# EasyEDA Pro project EasyEDApro.epro, schematic EnergyMeter
Create Date: 2023-12-29; Page Name: P1; Project Name: Energy Monitoring DIN dev release_v2_jack 3.5; Schematic Name: energy meter; Update Date: 2024-01-20; Company: ROBONOMICS.NETWORK; Drawed: ludovich88; Page Size: A3; Part Number: RNDR-1; Reviewed: EnsRationis; Version: 0.1
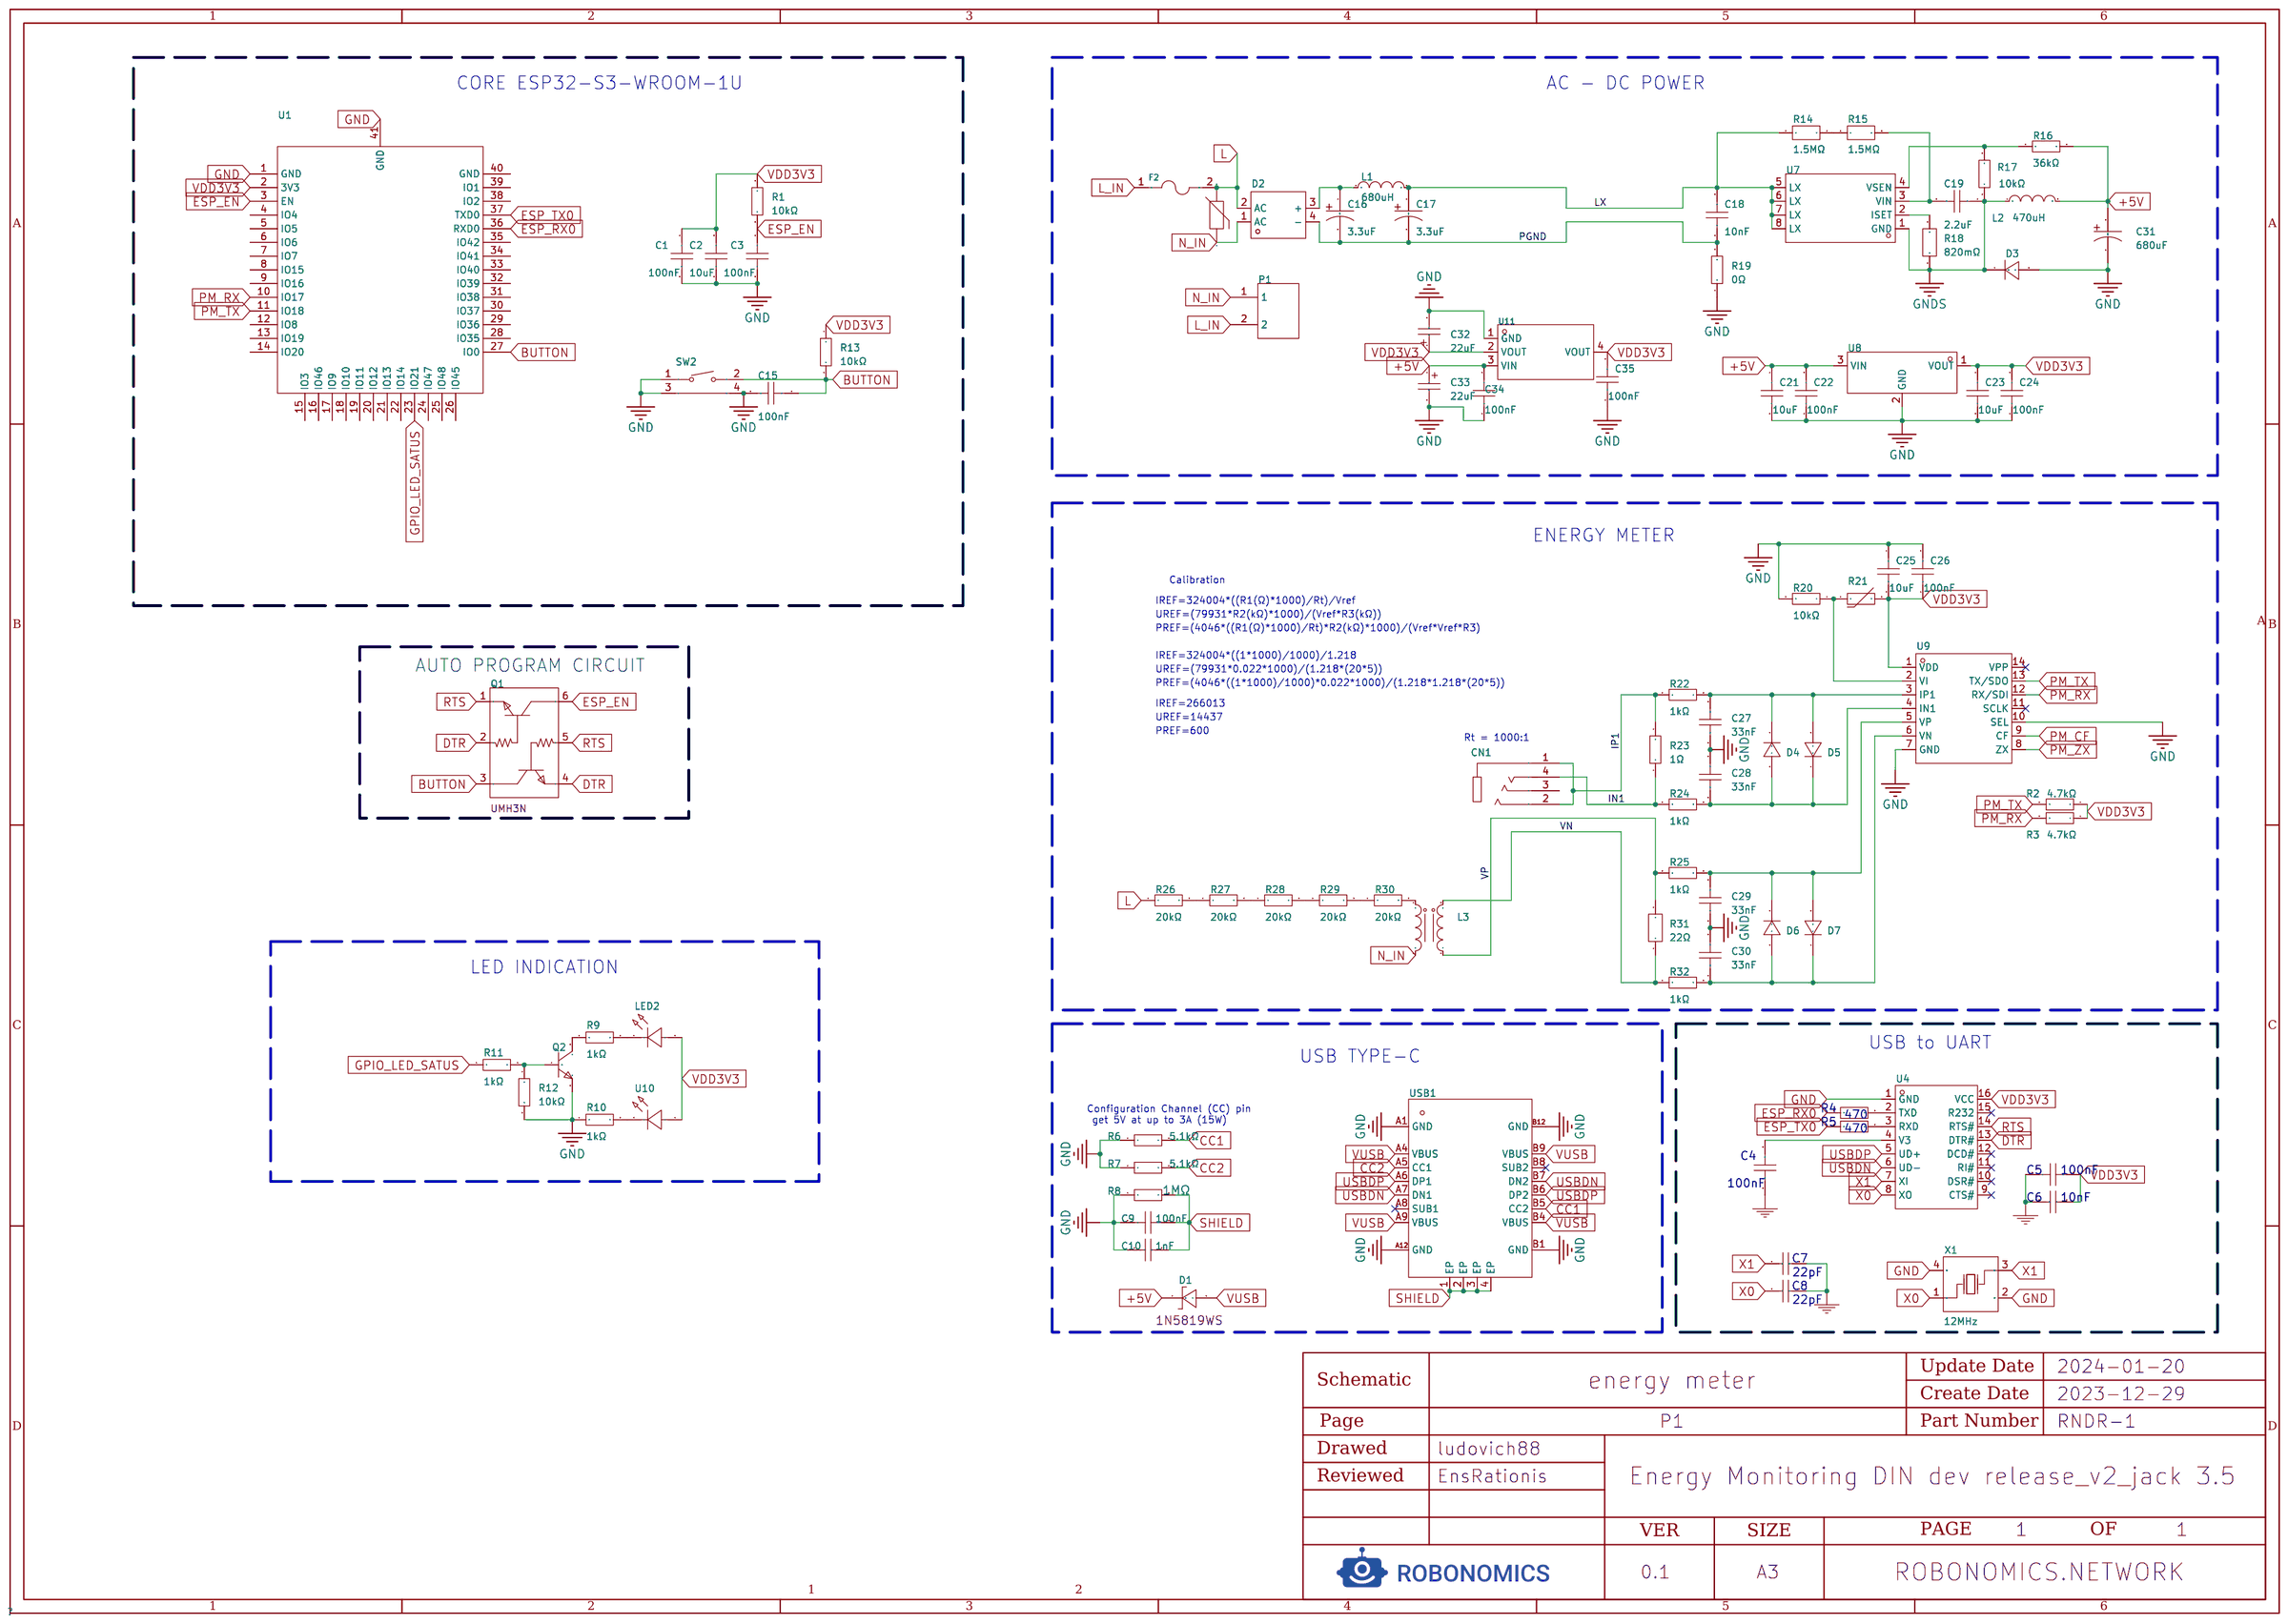
[diagram p0: schematic sheet]

## Parts
C1  100nF  [C0603]
C2  10uF  [c0603]
C3  100nF  [C0603]
C4  100nF  [C0603]
C5  100nF  [C0603]
C6  10nF  [C0603]
C7  22pF  [C0603]
C8  22pF  [C0603]
C9  100nF  [C0603]
C10  1nF  [C0603]
C15  100nF  [C0603]
C16  3.3uF  [CAP-TH_BD8.0-P3.50-D0.6-FD]
C17  3.3uF  [CAP-TH_BD8.0-P3.50-D0.6-FD]
C18  10nF  [C1206]
C19  2.2uF  [C0805]
C21  10uF  [C0603]  (no BOM)
C22  100nF  [C0603]  (no BOM)
C23  10uF  [C0603]  (no BOM)
C24  100nF  [C0603]  (no BOM)
C25  10uF  [C0603]
C26  100nF  [C0603]
C27  33nF  [C0603]
C28  33nF  [C0603]
C29  33nF  [C0603]
C30  33nF  [C0603]
C31  680uF  [CAP-SMD_L7.3-W4.3]
C32  22uF  [CASE-A_3216]
C33  22uF  [CASE-A_3216]
C34  100nF  [C0603]
C35  100nF  [C0603]
CN1  PJ-320D  [AUDIO-SMD_PJ-320D]
D1  -  [SOD-323_L1.8-W1.3-LS2.5-RD]
D2  MB10F  [MBF_L4.8-W3.9-P2.50-LS6.7-BL]
D3  ES1J  [SMA_L4.3-W2.6-LS5.2-RD]
D4  1N4148WS  [SOD-323_L1.8-W1.3-LS2.5-RD]
D5  1N4148WS  [SOD-323_L1.8-W1.3-LS2.5-RD]
D6  1N4148WS  [SOD-323_L1.8-W1.3-LS2.5-RD]
D7  1N4148WS  [SOD-323_L1.8-W1.3-LS2.5-RD]
F2  JFC2410-1200FS  [F2410]
L1  680uH  [IND-SMD_L6.0-W6.0]
L2  470uH  [IND-SMD_L4.0-W4.0]
L3  HPT225A-G  [XFMR-TH_4P-L19.0-10.0-P7.20]
LED2  XL-4008UGC  [LED-SMD_L4.0-W1.4-RD_GREEN]
P1  WJ128V-5.0-2P  [CONN-TH_2P-P5.00_WJ128V-5.0-2P]
Q1  -  [SC-70-6_L2.2-W1.3-P0.65-LS2.1-BR]
Q2  SS8050  [SOT-23-3_L2.9-W1.6-P1.90-LS2.8-BR]
R1  10kΩ  [R0603]
R2  4.7kΩ  [R0603]
R3  4.7kΩ  [R0603]
R4  470  [R0603]
R5  470  [R0603]
R6  5.1kΩ  [R0603]
R7  5.1kΩ  [R0603]
R8  1MΩ  [R0603]
R9  1kΩ  [R0603]
R10  1kΩ  [R0603]
R11  1kΩ  [R0603]
R12  10kΩ  [R0603]
R13  10kΩ  [R0603]
R14  1.5MΩ  [R1206]
R15  1.5MΩ  [R1206]
R16  36kΩ  [R0805]
R17  10kΩ  [R0805]
R18  820mΩ  [R0805]
R19  0Ω  [R0805]
R20  10kΩ  [R0603]
R21  SDNT2012X103F3950FTF  [R0805]
R22  1kΩ  [R0603]
R23  1Ω  [R0603]
R24  1kΩ  [R0603]
R25  1kΩ  [R0603]
R26  20kΩ  [R0603]
R27  20kΩ  [R0603]
R28  20kΩ  [R0603]
R29  20kΩ  [R0603]
R30  20kΩ  [R0603]
R31  22Ω  [R0603]
R32  1kΩ  [R0603]
RV1  RM07D471KC14E100  [RES-TH_L9.5-W3.8-P5.08-D0.6-S2.5]
SW2  TS-1010-C-A  [KEY-SMD_TX-1010-X-X]
U1  ESP32-S3-WROOM-1U-N16  [WIRELM-SMD_ESP32-S3-WROOM-1U]
U4  -  [SOIC-16_L9.9-W3.9-P1.27-LS6.0-BL]
U7  SY50282FAC  [SOIC-8_L4.9-W3.9-P1.27-LS6.0-BL]
U8  LD2981ABU33TR  [SOT-89-3_L4.5-W2.5-P1.50-LS4.2-BR]  (no BOM)
U9  BL0940  [TSSOP-14_L5.0-W4.4-P0.65-LS6.4-BL]
U10  XL-4008SURC  [LED-SMD_L4.0-W1.4-FD_C9900036310]
U11  AMS1117-3.3  [SOT-223-3_L6.5-W3.4-P2.30-LS7.0-BR]
USB1  KH-TYPE-C-16P  [USB-C-SMD_KH-TYPE-C-16P]
X1  12MHz  [OSC-SMD_4P-L3.2-W2.5-BL]

## Library data of the parts
C1 C3 = 0603F104Z500CT: Capacitance:100nFTolerance:-20%~+80%Tolerance:-20%~+80%VoltageRated:50VTemperatureCoefficient:Y5V; LCSC Part Name: 100nF-20%~+80%50V; Supplier Part: C83060; Manufacturer: 华新科(Walsin); Supplier Footprint: 0603; JLCPCB Part Class: ExtendedPart; Datasheet: https://atta.szlcsc.com/upload/public/pdf/source/20161119/1479540179445.pdf; Supplier: LCSC; Tolerance: -20%~+80%; Voltage Rated: 50V; Temperature Coefficient: Y5V
C2 = cl10a106kp8nnnc: 容值:10uF;精度:±10%;额定电压:10V;温度系数:X5R;; LCSC Part Name: 10uF±10%10V; Supplier Part: C19702; Manufacturer: SAMSUNG(三星); Manufacturer Part: CL10A106KP8NNNC; Supplier Footprint: 0603; JLCPCB Part Class: BasicPart; Datasheet: https://atta.szlcsc.com/upload/public/pdf/source/20160103/1457707703378.pdf; Supplier: LCSC; Tolerance: ±10%; Voltage Rated: 10V; Temperature Coefficient: X5R
C4 C5 = CC0603KRX7R9BB104: Supplier: LCSC; Manufacturer: YAGEO; Supplier Part: C14663; JLCPCB Part Class: BasicPart
C6 = 0603B103K500NT: Supplier: LCSC; Manufacturer: FH; Supplier Part: C57112; JLCPCB Part Class: BasicPart
C7 C8 = CL10C220JB8NNNC: Supplier: LCSC; Manufacturer: SAMSUNG; Supplier Part: C1653; JLCPCB Part Class: BasicPart
C9 = CC0603KRX7R9BB104: Capacitance:100nFTolerance:±10%Tolerance:±10%VoltageRated:50VTemperatureCoefficient:X7R; LCSC Part Name: 100nF±10%50V; Supplier Part: C14663; Manufacturer: YAGEO(国巨); Supplier Footprint: 0603; JLCPCB Part Class: BasicPart; Datasheet: https://atta.szlcsc.com/upload/public/pdf/source/20170116/1484561234239.pdf; Supplier: LCSC; Tolerance: ±10%; Voltage Rated: 50V; Temperature Coefficient: X7R
C10 = CL10B102KB8NNNC: Capacitance:1nFTolerance:±10%Tolerance:±10%VoltageRated:50VTemperatureCoefficient:X7R; LCSC Part Name: 1nF±10%50V; Supplier Part: C1588; Manufacturer: SAMSUNG(三星); Supplier Footprint: 0603; JLCPCB Part Class: BasicPart; Datasheet: https://atta.szlcsc.com/upload/public/pdf/source/20160103/1457707679526.pdf; Supplier: LCSC; Tolerance: ±10%; Voltage Rated: 50V; Temperature Coefficient: X7R
C15 C22 C24 C26 C34 C35 = 0603ZC104KAT2A: Capacitance:Tolerance:±10%Tolerance:±10%VoltageRated:TemperatureCoefficient:; LCSC Part Name: 100nF±10%10V; Supplier Part: C597251; Manufacturer: KyoceraAVX; Supplier Footprint: 0603; Datasheet: https://atta.szlcsc.com/upload/public/pdf/source/20200611/C596996_5C2870FCBE04273D0B42880C13DA8C38.pdf; Supplier: LCSC; Tolerance: ±10%
C16 C17 = RC400M3R3LO8*12TH-2A1E: Capacitance:Tolerance:±20%Tolerance:±20%RatedVoltage:φD:L:LeadSpacing:RippleCurrent:-Lifetime@Temp:-OperatingTemperature:-40℃~+105℃OperatingTemperature:-40℃~+105℃; LCSC Part Name: 3.3uF±20%400V; Supplier Part: C357600; Manufacturer: BERYL(绿宝石); Supplier Footprint: 插件,D8xL12mm; JLCPCB Part Class: ExtendedPart; Datasheet: https://atta.szlcsc.com/upload/public/pdf/source/20190103/C357600_EA153F20CFA28085E3801EB936F22A0F.pdf; Supplier: LCSC; Tolerance: ±20%; Operating Temperature: -40℃~+105℃
C18 = 1206B103K102CT_C77498: Capacitance:Tolerance:±10%Tolerance:±10%VoltageRated:TemperatureCoefficient:; LCSC Part Name: 10nF±10%1kV; Supplier Part: C77498; Manufacturer: Walsin(华新科); Manufacturer Part: 1206B103K102CT; Supplier Footprint: 1206; Datasheet: https://atta.szlcsc.com/upload/public/pdf/source/20180823/C77498_F5DB9DEE771DDE1CDD0779C01702A5D3.pdf; Supplier: LCSC; Tolerance: ±10%
C19 = CL21A225KBQNNNE: Capacitance:Tolerance:±10%Tolerance:±10%VoltageRated:TemperatureCoefficient:; LCSC Part Name: 2.2uF±10%50V; Supplier Part: C377773; Manufacturer: SAMSUNG(三星); Supplier Footprint: 0805; JLCPCB Part Class: ExtendedPart; Datasheet: https://atta.szlcsc.com/upload/public/pdf/source/20190327/C377773_F663556E8B678C5EA7A210E6B154453B.pdf; Supplier: LCSC; Tolerance: ±10%
C21 C23 C25 = CL10A106MQ8NNNC: Capacitance:Tolerance:±20%Tolerance:±20%VoltageRated:TemperatureCoefficient:; LCSC Part Name: 10uF±20%6.3V; Supplier Part: C1691; Manufacturer: SAMSUNG(三星); Supplier Footprint: 0603; JLCPCB Part Class: ExtendedPart; Datasheet: https://atta.szlcsc.com/upload/public/pdf/source/20160103/1457707690948.pdf; Supplier: LCSC; Tolerance: ±20%
C27-C30 = CC0603JRX7R9BB333: Capacitance:Tolerance:±5%Tolerance:±5%VoltageRated:TemperatureCoefficient:; LCSC Part Name: 33nF±5%50V; Supplier Part: C327162; Manufacturer: YAGEO(国巨); Supplier Footprint: 0603; JLCPCB Part Class: ExtendedPart; Datasheet: https://atta.szlcsc.com/upload/public/pdf/source/20181031/C327162_E0FA0E4D62FC939BEC1D516A6479F390.pdf; Supplier: LCSC; Tolerance: ±5%
C31 = TAJE687K006RNJ: Capacitance:Tolerance:±10%Tolerance:±10%RatedVoltage:EquivalentSeriesResistance(ESR):500mΩ@100kHzOperatingTemperature:-55℃~+125℃OperatingTemperature:-55℃~+125℃; LCSC Part Name: 680uF±10%6.3V; Supplier Part: C308811; Manufacturer: KyoceraAVX; Supplier Footprint: CASE-E-7343; JLCPCB Part Class: ExtendedPart; Datasheet: https://atta.szlcsc.com/upload/public/pdf/source/20181031/C308811_5A7B8BD02B1566F52935A1016FD2A024.pdf; Supplier: LCSC; Tolerance: ±10%; Equivalent Series Resistance(ESR): 500mΩ@100kHz; Operating Temperature: -55℃~+125℃
C32 C33 = TAJA226K010RNJ: Capacitance: Tolerance:±10% Tolerance:±10% Rated Voltage: Equivalent Series Resistance(ESR):3Ω@100kHz Operating Temperature:-55℃~+125℃ Operating Temperature:-55℃~+125℃; LCSC Part Name: 22uF ±10% 10V; Supplier Part: C11366; Manufacturer: Kyocera AVX; JLCPCB Part Class: Extended Part; Datasheet: https://atta.szlcsc.com/upload/public/pdf/source/20160107/1457707744993.pdf; Supplier: LCSC; Tolerance: ±10%; Equivalent Series Resistance(ESR): 3Ω@100kHz; Operating Temperature: -55℃~+125℃
CN1 = PJ-320D_C431535: Connector Type:3.5mm耳机座 Current Rating (Max):300mA Voltage Rating (Max):50V Operating Temperature Range:-16℃~+65℃ Operating Temperature Range:-16℃~+65℃; LCSC Part Name: 3.5mm耳机座; Supplier Part: C431535; Manufacturer: SHOU HAN(首韩); Supplier Footprint: SMD; JLCPCB Part Class: Extended Part; Datasheet: https://atta.szlcsc.com/upload/public/pdf/source/20190925/C431535_8B274506621F6117FB020BF07A197848.pdf; Supplier: LCSC; Connector Type: 3.5mm耳机座; Current Rating (Max): 300mA; Voltage Rating (Max): 50V; Operating Temperature Range: -16℃~+65℃
D1 = 1N5819WS: ReverseVoltage(Vr):40VAverageRectifiedCurrent(Io):1AForwardVoltage(Vf@If):600mV@1A; LCSC Part Name: 40V1A600mV@1A; Supplier Part: C191023; Manufacturer: Hottech(合科泰); Supplier Footprint: SOD-323; JLCPCB Part Class: BasicPart; Datasheet: https://atta.szlcsc.com/upload/public/pdf/source/20180614/C191023_3C6A6398B911F3A4C23E7538EE054643.pdf; Supplier: LCSC; Reverse Voltage (Vr): 40V; Average Rectified Current (Io): 1A; Forward Voltage (Vf@If): 600mV@1A
D2 = MB10F_C306850: ReverseVoltage(Vr):AverageRectifiedCurrent(Io):ForwardVoltage(Vf@If):1V@500mAReverseLeakageCurrent(Ir):5uA@1kVPeakForwardSurgeCurrent:OperatingTemperature:-55℃~+150℃@(Tj)OperatingTemperature:-55℃~+150℃@(Tj); LCSC Part Name: 1kV800mA; Supplier Part: C306850; Manufacturer: BORN(伯恩半导体); Supplier Footprint: MBF; JLCPCB Part Class: ExtendedPart; Datasheet: https://atta.szlcsc.com/upload/public/pdf/source/20180927/C306850_59365E2CFC1E948275A4282033719DF3.pdf; Supplier: LCSC; Forward Voltage (Vf@If): 1V@500mA; Reverse Leakage Current (Ir): 5uA@1kV; Operating Temperature: -55℃~+150℃@(Tj)
D3 = ES1J_C115404: Supplier Part: C115404; Manufacturer: 晶导微电子; Supplier Footprint: SMA(DO-214AC); Datasheet: https://atta.szlcsc.com/upload/public/pdf/source/20170704/1499151315665.pdf; Supplier: LCSC
D4-D7 = 1N4148WS_C2128: DiodeConfiguration:PowerDissipation:ReverseVoltage(Vr):AverageRectifiedCurrent(Io):ForwardVoltage(Vf@If):1.25V@150mAReverseLeakageCurrent:1uA@75VReverseRecoveryTime(trr):OperatingTemperature:+150℃@(Tj)OperatingTemperature:+150℃@(Tj; LCSC Part Name: 100V150mA4nsT4; Supplier Part: C2128; Manufacturer: CJ(江苏长电/长晶); Supplier Footprint: SOD-323; JLCPCB Part Class: BasicPart; Datasheet: https://atta.szlcsc.com/upload/public/pdf/source/20140809/1457707208178.pdf; Supplier: LCSC; Forward Voltage (Vf@If): 1.25V@150mA; Reverse Leakage Current: 1uA@75V; Operating Temperature: +150℃@(Tj)
F2 = JFC2410-1200FS: Type:SMD Fuse Current Rating:2A Voltage Rating  (AC):250V Breaking Capacity:50A Operating Temperature:-55℃~+125℃ Operating Temperature:-55℃~+125℃; LCSC Part Name: 250V贴片式保险丝; Supplier Part: C136365; Manufacturer: JDTfuse(集电通); Supplier Footprint: SMD; JLCPCB Part Class: Extended Part; Datasheet: https://atta.szlcsc.com/upload/public/pdf/source/20230515/4DD82964BD259009D7CA201DAB95185E.pdf; Supplier: LCSC; Type: SMD Fuse; Current Rating: 2A; Voltage Rating  (AC): 250V; Breaking Capacity: 50A; Operating Temperature: -55℃~+125℃
L1 = YNR6045-681M: Inductance:Tolerance:±20%Tolerance:±20%RatedCurrent:DCResistance(DCR):; LCSC Part Name: 680uH±20%330mA2.5Ω; Supplier Part: C497844; Manufacturer: YJYCOIN(益嘉源); Supplier Footprint: SMD,6x6mm; JLCPCB Part Class: ExtendedPart; Datasheet: https://atta.szlcsc.com/upload/public/pdf/source/20200317/C497838_ADAADDA66AFC043F2D8B9A62FB946728.pdf; Supplier: LCSC; Tolerance: ±20%
L2 = PNLS4030-471: Inductance: Tolerance:±20% Tolerance:±20% Rated Current: Type:磁胶电感 DC Resistance (DCR): Saturation Current (Isat):- Ratings:-; LCSC Part Name: 470uH ±20%; Supplier Part: C2849480; Manufacturer: DMBJ(振宝佳); Supplier Footprint: SMD,4x4x3mm; JLCPCB Part Class: Extended Part; Datasheet: https://atta.szlcsc.com/upload/public/pdf/source/20211011/C2849563_90EF936162E15AB6B17B47214801A168.pdf; Supplier: LCSC; Tolerance: ±20%; Type: 磁胶电感
L3 = HPT225A-G: CurrentRatio:1:1CurrentRating:2mAFrequencyRange:0.02kHz~10kHzSecondarySideInductance:-DCRPrimarySide(Max):115ΩDCRSecondarySide(Max):115ΩHighPotential:4000V@AC; Supplier Part: C254112; Manufacturer: HOP(北京霍远); Supplier Footprint: 插件; JLCPCB Part Class: ExtendedPart; Datasheet: https://atta.szlcsc.com/upload/public/pdf/source/20201208/C254112_A7B3C0B9ED08E71DD9E60AC055CA5EE3.pdf; Supplier: LCSC; Current Ratio: 1:1; Current Rating: 2mA; Frequency Range: 0.02kHz~10kHz; DCR Primary Side (Max): 115Ω; DCR Secondary Side (Max): 115Ω; High Potential: 4000V@AC
LED2 = XL-4008UGC: EmittedColor:EmeraldLensColor:ColorlesstransparenceDominantWavelength:520nm~525nmDominantWavelength:520nm~525nmPeakWavelength:525nmForwardCurrent:50mAPowerDissipation:125mWViewingAngle:120°MountingSytle:SidestickersOperatingTemperatur; LCSC Part Name: 侧贴; Supplier Part: C2843772; Manufacturer: XINGLIGHT(成兴光); Supplier Footprint: SMD,1.4x4mm; JLCPCB Part Class: ExtendedPart; Datasheet: https://atta.szlcsc.com/upload/public/pdf/source/20221102/5120FC94C7C2123DB0544AD5FB85956A.pdf; Supplier: LCSC; Emitted Color: Emerald; Lens Color: Colorlesstransparence; Dominant Wavelength: 520nm~525nm; Peak Wavelength: 525nm; Forward Current: 50mA; Power Dissipation: 125mW; Viewing Angle: 120°; Mounting Sytle: Sidestickers; Operating Temperature: -30℃~+85℃
P1 = WJ128V-5.0-2P: Pitch:5mmStructure:1x2PNumberofRows:1NumberofPINsPerRow:2MountingStyle:直针CurrentRating(Max):20AVoltageRating(Max):250VWireGauge-AWG:12~22WireGauge-AWG:12~22WireGauge-mm2:2.5WireGauge-mm2:2.5OperatingTemperatureRange:-40; LCSC Part Name: 5mm1x2P排数:1每排P数:2直针可拼接; Supplier Part: C8269; Manufacturer: KANGNEX(康奈克斯电气); Supplier Footprint: 插件,P=5mm; JLCPCB Part Class: ExtendedPart; Datasheet: https://atta.szlcsc.com/upload/public/pdf/source/20191225/C8269_1FF44D6D2E83DB14A7CA266A410FD9AD.pdf; Supplier: LCSC; Pitch: 5mm; Structure: 1x2P; Number of Rows: 1; Number of PINs Per Row: 2; Mounting Style: 直针; Current Rating (Max): 20A; Voltage Rating (Max): 250V; Wire Gauge - AWG: 12~22; Wire Gauge - mm2: 2.5; Operating Temperature Range: -40℃~+105℃; Color: Green
Q1 = UMH3N: TransistorType:2个NPN-预偏置PowerDissipation(Pd):150mWCollectorCurrent(Ic):100mACollector-EmitterBreakdownVoltage(Vceo):50V; LCSC Part Name: 2个NPN-预偏置100mA50V; Supplier Part: C62892; Manufacturer: CJ(江苏长电/长晶); Supplier Footprint: SC-70-6(SOT-363); JLCPCB Part Class: ExtendedPart; Datasheet: https://atta.szlcsc.com/upload/public/pdf/source/20151109/1457707575095.pdf; Supplier: LCSC; Transistor Type: 2个NPN-预偏置; Power Dissipation (Pd): 150mW; Collector Current (Ic): 100mA; Collector-Emitter Breakdown Voltage (Vceo): 50V
Q2 = SS8050_C181160: TransistorType:Collector-EmitterBreakdownVoltage(Vceo):CollectorCurrent(Ic):PowerDissipation(Pd):CollectorCut-OffCurrent(Icbo):100nACollector-EmitterSaturationVoltage(VCE(sat)@Ic,Ib):500mV@800mA,80mADCCurrentGain(hFE@Ic,Vce):200@100; LCSC Part Name: NPN25V1.5AH档（200-350）; Supplier Part: C181160; Manufacturer: Hottech(合科泰); Supplier Footprint: SOT-23; JLCPCB Part Class: ExtendedPart; Datasheet: https://atta.szlcsc.com/upload/public/pdf/source/20220506/87BBA77FEE9CB4B19031AE933C67329E.pdf; Supplier: LCSC; Collector Cut-Off Current (Icbo): 100nA; Collector-Emitter Saturation Voltage (VCE(sat)@Ic,Ib): 500mV@800mA,80mA; DC Current Gain (hFE@Ic,Vce): 200@100mA,1V; Transition Frequency (fT): 100MHz; Operating Temperature: +150℃@(Tj)
R1 R12 R13 R20 = 0603WAF1002T5E: Type:厚膜电阻 Resistance:10kΩ Tolerance:±1% Tolerance:±1% Power(Watts):1/10W Temperature Coefficient:±100ppm/ Temperature Coefficient:±100ppm/ Overload Voltage (Max):75V Operating Temperature Range:-55~+155 Operating Temperature Range:-55~+155; LCSC Part Name: 10kΩ±1%1/10W; Supplier Part: C25804; Manufacturer: UNI-ROYAL(厚声); Supplier Footprint: 0603; JLCPCB Part Class: BasicPart; Datasheet: https://atta.szlcsc.com/upload/public/pdf/source/20200306/C422600_1E6D84923E4A46A82E41ADD87F860B5C.pdf; Supplier: LCSC; Type: 厚膜电阻; Tolerance: ±1%; Power(Watts): 1/10W; Temperature Coefficient: ±100ppm/; Overload Voltage (Max): 75V; Operating Temperature Range: -55~+155
R2 R3 = RMC06034K7JN: Resistance:Tolerance:±5%Tolerance:±5%Power(Watts):; LCSC Part Name: 4.7kΩ±5%100mW; Supplier Part: C269694; Manufacturer: Tyohm(幸亚电阻); Supplier Footprint: 0603; JLCPCB Part Class: ExtendedPart; Datasheet: https://atta.szlcsc.com/upload/public/pdf/source/20190115/C269694_8DB59FA47BFB5717A32940FE118C845B.pdf; Supplier: LCSC; Tolerance: ±5%
R4 R5 = 0603WAF4700T5E: Supplier: LCSC; Manufacturer: UniOhm; Supplier Part: C23179; JLCPCB Part Class: BasicPart
R6 R7 = 0603WAF5101T5E: Type:厚膜电阻 Resistance:5.1kΩ Tolerance:±1% Power(Watts):1/10W Temperature Coefficient:±100ppm/ Temperature Coefficient:±100ppm/ Overload Voltage (Max):75V Operating Temperature Range:-55~+155 Operating Temperature Range:-55~+155; LCSC Part Name: 5.1kΩ±1%; Supplier Part: C23186; Manufacturer: UNI-ROYAL(厚声); Supplier Footprint: 0603; JLCPCB Part Class: BasicPart; Datasheet: https://atta.szlcsc.com/upload/public/pdf/source/20200306/C422600_1E6D84923E4A46A82E41ADD87F860B5C.pdf; Supplier: LCSC; Type: 厚膜电阻; Tolerance: ±1%; Power(Watts): 1/10W; Temperature Coefficient: ±100ppm/; Overload Voltage (Max): 75V; Operating Temperature Range: -55~+155
R8 = 0603WAF1004T5E: LCSC Part Name: 1MΩ(1004)±1%编带; Supplier Part: C22935; Manufacturer: UNI-ROYAL(厚声); Supplier Footprint: 0603; JLCPCB Part Class: BasicPart; Datasheet: https://atta.szlcsc.com/upload/public/pdf/source/20170920/C22935_1505900992858982324.pdf; Supplier: LCSC
R9-R11 = RC0603FR-071KL: Resistance:Tolerance:±1%Tolerance:±1%Power(Watts):TemperatureCoefficient:±100ppm/℃TemperatureCoefficient:±100ppm/℃OverloadVoltage(Max):OperatingTemperatureRange:-55℃~+155℃OperatingTemperatureRange:-55℃~+155℃; LCSC Part Name: 1kΩ±1%100mW; Supplier Part: C22548; Manufacturer: YAGEO(国巨); Supplier Footprint: 0603; JLCPCB Part Class: ExtendedPart; Datasheet: https://atta.szlcsc.com/upload/public/pdf/source/20180312/7BD3618A8B6324EA6280B0497A051AB7.pdf; Supplier: LCSC; Tolerance: ±1%; Temperature Coefficient: ±100ppm/℃; Operating Temperature Range: -55℃~+155℃
R14 R15 = AC1206FR-071M5L: Power(Watts):250mWBodyLength:-Tolerance:OperatingTemperatureRange:OperatingTemperatureRange:φD:-BodyHeight:-Resistance:BodyWidth:-Type:ThickFilmResistorsTemperatureCoefficient:TemperatureCoefficient:OverloadVoltage(Max):; LCSC Part Name: 1.5MΩ±1%; Supplier Part: C229411; Manufacturer: YAGEO(国巨); Supplier Footprint: 1206; JLCPCB Part Class: ExtendedPart; Datasheet: https://atta.szlcsc.com/upload/public/pdf/source/20190415/C229411_FA1574342AB9C159EA3612F925293BBE.pdf; Supplier: LCSC; Power(Watts): 250mW; Type: ThickFilmResistors
R16 = 0805W8F3602T5E: Type:ThickFilmResistorsResistance:Tolerance:±1%Tolerance:±1%Power(Watts):TemperatureCoefficient:±100ppm/℃TemperatureCoefficient:±100ppm/℃OverloadVoltage(Max):OperatingTemperatureRange:-55℃~+155℃OperatingTemperatureRange:-55℃~+155℃; LCSC Part Name: 36kΩ±1%125mW; Supplier Part: C4360; Manufacturer: UNI-ROYAL(厚声); Supplier Footprint: 0805; JLCPCB Part Class: BasicPart; Datasheet: https://atta.szlcsc.com/upload/public/pdf/source/20200306/C422600_1E6D84923E4A46A82E41ADD87F860B5C.pdf; Supplier: LCSC; Type: ThickFilmResistors; Tolerance: ±1%; Temperature Coefficient: ±100ppm/℃; Operating Temperature Range: -55℃~+155℃
R17 = 0805W8F1002T5E: Type:ThickFilmResistorsResistance:Tolerance:±1%Tolerance:±1%Power(Watts):TemperatureCoefficient:±100ppm/℃TemperatureCoefficient:±100ppm/℃OverloadVoltage(Max):OperatingTemperatureRange:-55℃~+155℃OperatingTemperatureRange:-55℃~+155℃; LCSC Part Name: 10kΩ±1%125mW; Supplier Part: C17414; Manufacturer: UNI-ROYAL(厚声); Supplier Footprint: 0805; JLCPCB Part Class: BasicPart; Datasheet: https://atta.szlcsc.com/upload/public/pdf/source/20200306/C422600_1E6D84923E4A46A82E41ADD87F860B5C.pdf; Supplier: LCSC; Type: ThickFilmResistors; Tolerance: ±1%; Temperature Coefficient: ±100ppm/℃; Operating Temperature Range: -55℃~+155℃
R18 = 0805W8F820LT5E: Resistance:820mΩ Tolerance:±1% Tolerance:±1% Power(Watts): Overload Voltage (Max): Temperature Coefficient:±800ppm/℃ Temperature Coefficient:±800ppm/℃ Type:Thick Film Resistors Operating Temperature Range:-55℃~+155℃ Operating Temperature Range:-55℃~+155℃; LCSC Part Name: 820mΩ ±1% 125mW 厚膜电阻; Supplier Part: C25267; Manufacturer: UNI-ROYAL(厚声); Supplier Footprint: 0805; JLCPCB Part Class: Extended Part; Datasheet: https://atta.szlcsc.com/upload/public/pdf/source/20200306/C422600_1E6D84923E4A46A82E41ADD87F860B5C.pdf; Supplier: LCSC; Type: Thick Film Resistors; Tolerance: ±1%; Temperature Coefficient: ±800ppm/℃; Operating Temperature Range: -55℃~+155℃
R19 = 0805W8J0000T5E: Type:ThickFilmResistorsResistance:Tolerance:±5%Tolerance:±5%Power(Watts):OverloadVoltage(Max):OperatingTemperatureRange:-55℃~+155℃OperatingTemperatureRange:-55℃~+155℃; LCSC Part Name: 0Ω±5%125mW; Supplier Part: C25275; Manufacturer: UNI-ROYAL(厚声); Supplier Footprint: 0805; Datasheet: https://atta.szlcsc.com/upload/public/pdf/source/20200306/C422600_1E6D84923E4A46A82E41ADD87F860B5C.pdf; Supplier: LCSC; Type: ThickFilmResistors; Tolerance: ±5%; Operating Temperature Range: -55℃~+155℃
R21 = SDNT2012X103F3950FTF: Resistance@25℃:ResistanceTolerance:BConstantTolerance:BConstant(25℃/50℃):Power:SteadyStateCurrent(Max):0.44mABConstant(25℃/75℃):-BConstant(25℃/85℃):-BConstant(25℃/100℃):-OperatingTemperature:-55℃~+125℃OperatingTemperature:-55℃~; LCSC Part Name: 10kΩ电阻精度:±1%3950K; Supplier Part: C95968; Manufacturer: Sunlord(顺络); Supplier Footprint: 0805; JLCPCB Part Class: ExtendedPart; Datasheet: https://atta.szlcsc.com/upload/public/pdf/source/20210916/BF106A3565EDFEB141CB3E0EA3A661F8.pdf; Supplier: LCSC; Steady State Current (Max): 0.44mA; Operating Temperature: -55℃~+125℃
R22 R24 R25 R32 = RT0603BRD071KL: Type:Thin Film Resistor Resistance: Tolerance:±0.1% Tolerance:±0.1% Power(Watts): Temperature Coefficient:±25ppm/℃ Temperature Coefficient:±25ppm/℃ Overload Voltage (Max): Operating Temperature Range:-55℃~+155℃ Operating Temperature Range:-55℃~+155℃; LCSC Part Name: 1kΩ ±0.1% 100mW; Supplier Part: C110776; Manufacturer: YAGEO(国巨); Supplier Footprint: 0603; JLCPCB Part Class: Extended Part; Datasheet: https://atta.szlcsc.com/upload/public/pdf/source/20170704/1499151282044.pdf; Supplier: LCSC; Type: Thin Film Resistor; Tolerance: ±0.1%; Temperature Coefficient: ±25ppm/℃; Operating Temperature Range: -55℃~+155℃
R23 = 0603WAF100KT5E: Type:ThickFilmResistorsResistance:Tolerance:±1%Tolerance:±1%Power(Watts):TemperatureCoefficient:±400ppm/℃TemperatureCoefficient:±400ppm/℃OverloadVoltage(Max):OperatingTemperatureRange:-55℃~+155℃OperatingTemperatureRange:-55℃~+155℃; LCSC Part Name: 1Ω±1%100mW; Supplier Part: C22936; Manufacturer: UNI-ROYAL(厚声); Supplier Footprint: 0603; JLCPCB Part Class: BasicPart; Datasheet: https://atta.szlcsc.com/upload/public/pdf/source/20200306/C422600_1E6D84923E4A46A82E41ADD87F860B5C.pdf; Supplier: LCSC; Type: ThickFilmResistors; Tolerance: ±1%; Temperature Coefficient: ±400ppm/℃; Operating Temperature Range: -55℃~+155℃
R26-R30 = RMC060320K5%N: Resistance:Tolerance:±5%Tolerance:±5%Power(Watts):; LCSC Part Name: 20kΩ±5%100mW; Supplier Part: C269687; Manufacturer: Tyohm(幸亚电阻); Supplier Footprint: 0603; JLCPCB Part Class: ExtendedPart; Datasheet: https://atta.szlcsc.com/upload/public/pdf/source/20190115/C269687_69A4A0E4D1D819843C4DF5B029A253CB.pdf; Supplier: LCSC; Tolerance: ±5%
R31 = TD03G22R0BT: TemperatureCoefficient:TemperatureCoefficient:Tolerance:Power(Watts):Resistance:OverloadVoltage(Max):OperatingTemperatureRange:OperatingTemperatureRange:; LCSC Part Name: 22Ω(22R0)±0.1%1/10W; Supplier Part: C657279; Manufacturer: FH(风华); Supplier Footprint: 0603; JLCPCB Part Class: ExtendedPart; Datasheet: https://atta.szlcsc.com/upload/public/pdf/source/20200616/C657321_2CFA27FA726BC0D0F6223AF922169515.pdf; Supplier: LCSC
RV1 = RM07D471KC14E100: Varistor Voltage:470V Varistor Voltage:470V Clamping Voltage: Allowable Voltage (DC): Allowable Voltage (AC): Peak Current:1250A Maximum Energy:29J Maximum Energy:29J Typical Capatitance:105pF@1kHz Rated Wattage:0.25W; LCSC Part Name: 钳位电压775V 29焦耳 插件压敏电阻; Supplier Part: C2974819; Manufacturer: Dersonic(德尔创); Supplier Footprint: 插件,P=5.08mm; JLCPCB Part Class: Extended Part; Datasheet: https://atta.szlcsc.com/upload/public/pdf/source/20220216/D8DC692F05B9B06F05572F275B453E59.pdf; Supplier: LCSC; Varistor Voltage: 470V; Peak Current: 1250A; Maximum Energy: 29J; Typical Capatitance: 105pF@1kHz; Rated Wattage: 0.25W
SW2 = TS-1010-C-A: ContactCurrent:50mAVoltageRating(DC):12VInsulationResistance:-Circuit:SPSTMountingStyle:SurfaceMountActuatorStyle:RectanglebuttonActuator/CapColor:BlackWithLamp:NoOperatingForce:260gfMechanicalLife:100000次OperatingTemperature:-30℃~+; LCSC Part Name: 卧贴2*4*3.5mm轻触开关; Supplier Part: C692458; Manufacturer: XKBConnectivity(中国星坤); Supplier Footprint: SMD; JLCPCB Part Class: ExtendedPart; Datasheet: https://atta.szlcsc.com/upload/public/pdf/source/20211011/09621D275CE0F472C941775DFBBCCC96.pdf; Supplier: LCSC; Contact Current: 50mA; Voltage Rating (DC): 12V; Circuit: SPST; Mounting Style: SurfaceMount; Actuator Style: Rectanglebutton; Actuator/Cap Color: Black; With Lamp: No; Operating Force: 260gf; Mechanical Life: 100000次; Operating Temperature: -30℃~+85℃; Switch Length: 2mm; Switch Width: 4mm; Switch Height: 3.5mm; Strike Gundam: NO
U1 = ESP32-S3-WROOM-1U-N16: Supplier Part: C2980298; Manufacturer: ESPRESSIF(乐鑫); Supplier Footprint: SMD,18x19.2mm; JLCPCB Part Class: ExtendedPart; Datasheet: https://atta.szlcsc.com/upload/public/pdf/source/20220628/A2AC12B3C87735CAEB7EBE2DBE80936C.pdf; Supplier: LCSC
U4 = CH340G: Type:TransceiverProtocol:USB2.0NumberofDrivers/Receivers:-DataRate:2MbpsSupplyVoltage:3.3V,5V; Supplier Part: C14267; Manufacturer: WCH(南京沁恒); Supplier Footprint: SOP-16_150mil; JLCPCB Part Class: ExtendedPart; Datasheet: https://atta.szlcsc.com/upload/public/pdf/source/20200819/C14267_9F0B4B8160AEBA86F3219E64956E4601.pdf; Supplier: LCSC; Type: Transceiver; Protocol: USB2.0; Data Rate: 2Mbps; Supply Voltage: 3.3V,5V
U7 = SY50282FAC: Supplier Part: C178237; Manufacturer: silergy(矽力杰); Supplier Footprint: SOIC-8; JLCPCB Part Class: ExtendedPart; Datasheet: https://atta.szlcsc.com/upload/public/pdf/source/20180207/C178237_15179896323851356347.pdf; Supplier: LCSC
U8 = LD2981ABU33TR: OutputType:OutputPolarity:PositiveNumberofOutputs:1MaximumInputVoltage:16VOutputVoltage:3.3V~3.3VOutputVoltage:3.3V~3.3VDropoutVoltage:375mV@(100mA)OutputCurrent:100mAPowerSupplyRejectionRatio(PSRR):63dB@(1kHz); LCSC Part Name: 正Vin=16VVout=3.3V100mA63dB@(1kHz); Supplier Part: C221514; Manufacturer: ST(意法半导体); Supplier Footprint: SOT-89-3; JLCPCB Part Class: ExtendedPart; Datasheet: https://atta.szlcsc.com/upload/public/pdf/source/20180517/C221514_2D86246316B4A3FA0379065A5BE313C7.pdf; Supplier: LCSC; Output Polarity: Positive; Number of Outputs: 1; Maximum Input Voltage: 16V; Output Voltage: 3.3V~3.3V; Dropout Voltage: 375mV@(100mA); Output Current: 100mA; Power Supply Rejection Ratio (PSRR): 63dB@(1kHz)
U9 = BL0940: LCSC Part Name: 电能计量芯片; Supplier Part: C691894; Manufacturer: BL(上海贝岭); Supplier Footprint: TSSOP-14; JLCPCB Part Class: ExtendedPart; Datasheet: https://atta.szlcsc.com/upload/public/pdf/source/20200628/C691894_DF23B4F5A06D0F64D9A7C5BC935783C1.pdf; Supplier: LCSC
U10 = XL-4008SURC: EmittedColor:红灯LensColor:ColorlesstransparenceDominantWavelength:620nm~625nmDominantWavelength:620nm~625nmPeakWavelength:625nmForwardCurrent:50mAPowerDissipation:125mWViewingAngle:120°MountingSytle:SidestickersOperatingTemperature:-30; LCSC Part Name: 红灯侧贴; Supplier Part: C2843771; Manufacturer: XINGLIGHT(成兴光); Supplier Footprint: SMD,1.4x4mm; JLCPCB Part Class: ExtendedPart; Datasheet: https://atta.szlcsc.com/upload/public/pdf/source/20221102/EAC0B38F8924C881A99BE374D0B10640.pdf; Supplier: LCSC; Emitted Color: 红灯; Lens Color: Colorlesstransparence; Dominant Wavelength: 620nm~625nm; Peak Wavelength: 625nm; Forward Current: 50mA; Power Dissipation: 125mW; Viewing Angle: 120°; Mounting Sytle: Sidestickers; Operating Temperature: -30℃~+85℃
U11 = AMS1117-3.3_C6186: Output Type: Maximum Input Voltage:- Output Voltage:3.3V Output Voltage:3.3V MAX Output Current:1A Power Supply Rejection Ratio (PSRR):72dB@(120Hz) Dropout Voltage:1.3V@(800mA) standby current:- Noise:- Feature:- Operating Temperature:- Operating Temperat; LCSC Part Name: 输出3.3V 1A; Supplier Part: C6186; Manufacturer: AMS; Supplier Footprint: SOT-223-3; JLCPCB Part Class: Basic Part; Datasheet: https://atta.szlcsc.com/upload/public/pdf/source/20180727/C6186_7A095716F0823C02F1997A905E26C086.pdf; Supplier: LCSC; Output Voltage: 3.3V; MAX Output Current: 1A; Power Supply Rejection Ratio (PSRR): 72dB@(120Hz); Dropout Voltage: 1.3V@(800mA); Output Polarity: Positive electrode; Number of Outputs: 1
USB1 = KH-TYPE-C-16P: ConnectorType:Type-CStandard:-Gender:FemaleNumberofContacts:16NumberofPorts:1MountingStyle:SurfaceMountCurrentRating-Power(Max):3AOperatingTemperatureRange:-40℃~+85℃OperatingTemperatureRange:-40℃~+85℃; LCSC Part Name: Type-C母座卧贴; Supplier Part: C709357; Manufacturer: kinghelm(金航标); Supplier Footprint: SMD; Datasheet: https://atta.szlcsc.com/upload/public/pdf/source/20200911/C709357_AA8DCEB38BB20E3035A7ED7AE7667837.pdf; Supplier: LCSC; Connector Type: Type-C; Gender: Female; Number of Contacts: 16; Number of Ports: 1; Mounting Style: SurfaceMount; Current Rating - Power (Max): 3A; Operating Temperature Range: -40℃~+85℃
X1 = X322512MSB4SI: Crystal Type:贴片无源晶振 Frequency:12MHz Frequency Tolerance:±10ppm Frequency Tolerance:±10ppm Frequency Stability:±30ppm Frequency Stability:±30ppm Load Capacitance:20pF Operating Temperature:-40~+85 Operating Temperature:-40~+85; LCSC Part Name: 12MHz±10ppm20pF; Supplier Part: C9002; Manufacturer: YXC扬兴科技; Supplier Footprint: SMD3225-4P; JLCPCB Part Class: BasicPart; Datasheet: https://atta.szlcsc.com/upload/public/pdf/source/20210329/C112971_1F611BDC486E193C1706F6D8EB5AA189.pdf; Supplier: LCSC; Crystal Type: 贴片无源晶振; Frequency Tolerance: ±10ppm; Frequency Stability: ±30ppm; Load Capacitance: 20pF; Operating Temperature: -40~+85

## Nets
+5V: C21.1 C22.2 C31.1 C33.1 C34.2 D1.1(C) L2.2 R16.1 U8.3(VIN) U11.3(VIN)
GND: C1.2 C2.1 C3.2 C4.1 C5.2 C6.2 C7.1 C8.1 C9.1 C10.1 C15.2 C21.2 C22.1 C23.2 C24.1 C25.1 C26.2 C27.1 C28.2 C29.1 C30.2 C31.2 C32.2 C33.2 C34.1 C35.1 D3.2(A) Q2.2(E) R6.1 R7.1 R8.1 R10.1 R12.2 R19.1 R20.2 SW2.1 SW2.3 SW2.4 U1.1(GND) U1.41(GND) U4.1(GND) U8.2(GND) U9.7(GND) U9.10(SEL) U11.1(GND) USB1.A1(GND) USB1.A12(GND) USB1.B1(GND) USB1.B12(GND) X1.2(GND) X1.4(GND)
GNDS: C19.1 D3.1(C) L2.1 R17.1 R18.1 U7.1(GND)
PGND: C16.2 C17.2 C18.1 D2.4(-) R19.2
VDD3V3: C1.1 C2.2 C5.1 C6.1 C23.1 C24.2 C25.2 C26.1 C32.1 C35.2 LED2.2(A) R1.1 R2.1 R3.1 R13.1 R21.2 U1.2(3V3) U4.16(VCC) U8.1(VOUT) U9.1(VDD) U10.1(A) U11.2(VOUT) U11.4(VOUT)
BUTTON: C15.1 Q1.3(C) R13.2 SW2.2 U1.27(IO0)
CC1: R6.2 USB1.B5(CC2)
CC2: R7.2 USB1.A5(CC1)
DTR: Q1.2(B) Q1.4(E) U4.13(DTR#)
ESP_EN: C3.1 Q1.6(C) R1.2 U1.3(EN)
ESP_RX0: R4.1 U1.36(RXD0)
ESP_TX0: R5.1 U1.37(TXD0)
GPIO_LED_SATUS: R11.1 U1.23(IO21)
IN1: CN1.4 R23.1 R24.1
IP1: CN1.1 CN1.2 R22.1 R23.2
L: D2.2(AC) F2.2 R26.1 RV1.2
L_IN: F2.1 P1.2
LX: C17.1 C18.2 L1.2 R14.1 U7.5(LX) U7.6(LX) U7.7(LX) U7.8(LX)
N_IN: D2.1(AC) L3.2 P1.1 RV1.1
PM_CF: U9.9(CF)
PM_RX: R3.2 U1.10(IO17) U9.12(RX/SDI)
PM_TX: R2.2 U1.11(IO18) U9.13(TX/SDO)
PM_ZX: U9.8(ZX)
RTS: Q1.1(E) Q1.5(B) U4.14(RTS#)
SHIELD: C9.2 C10.2 R8.2 USB1.1(EP) USB1.2(EP) USB1.3(EP) USB1.4(EP)
USBDN: U4.6(UD-) USB1.A7(DN1) USB1.B7(DN2)
USBDP: U4.5(UD+) USB1.A6(DP1) USB1.B6(DP2)
VN: L3.3 R31.1 R32.1
VP: L3.4 R25.1 R31.2
VUSB: D1.2(A) USB1.A4(VBUS) USB1.A9(VBUS) USB1.B4(VBUS) USB1.B9(VBUS)
X0: C8.2 U4.8(XO) X1.1(OSC1)
X1: C7.2 U4.7(XI) X1.3(OSC2)
$1N2408: R20.1 R21.1 U9.2(VI)
$1N2433: R14.2 R15.1
$1N2434: R18.2 U7.2(ISET)
$1N2435: C19.2 R15.2 U7.3(VIN)
$1N2436: R16.2 R17.2 U7.4(VSEN)
$1N6043: Q2.3(C) R9.1
$1N6046: Q2.1(B) R11.2 R12.1
$1N6113: C4.2 U4.4(V3)
$1N6115: R5.2 U4.3(RXD)
$1N6116: R4.2 U4.2(TXD)
$1N10199: R29.2 R30.1
$1N10201: R28.2 R29.1
$1N10203: R27.2 R28.1
$1N10205: R26.2 R27.1
$1N11192: C27.2 D4.1(K) D5.2(A) R22.2 U9.3(IP1)
$1N11195: C28.1 D4.2(A) D5.1(K) R24.2 U9.4(IN1)
$1N11200: C29.2 D6.1(K) D7.2(A) R25.2 U9.5(VP)
$1N11209: C30.1 D6.2(A) D7.1(K) R32.2 U9.6(VN)
$1N11609: C16.1 D2.3(+) L1.1
$1N21646: LED2.1(K) R9.2
$1N25048: R10.2 U10.2(K)
$1N34811: L3.1 R30.2

Not connected (* = marked no-connect by the designer): CN1 3; U1 4(IO4) 5(IO5) 6(IO6) 7(IO7) 8(IO15) 9(IO16) 12(IO8) 13(IO19) 14(IO20) 15(IO3) 16(IO46) 17(IO9) 18(IO10) 19(IO11) 20(IO12) 21(IO13) 22(IO14) 24(IO47) 25(IO48) 26(IO45) 28(IO35) 29(IO36) 30(IO37) 31(IO38) 32(IO39) 33(IO40) 34(IO41) 35(IO42) 38(IO2) 39(IO1) 40(GND); U4 9(CTS#)* 10(DSR#)* 11(RI#)* 12(DCD#)* 15(R232)*; U9 11(SCLK)* 14(VPP)*; USB1 A8(SUB1)* B8(SUB2)*

## Notes on the sheet
- CORE ESP32-S3-WROOM-1U
- AC - DC POWER
- ENERGY METER
- Calibration
- IREF=324004*((R1(Ω)*1000)/Rt)/Vref
- UREF=(79931*R2(kΩ)*1000)/(Vref*R3(kΩ))
- PREF=(4046*((R1(Ω)*1000)/Rt)*R2(kΩ)*1000)/(Vref*Vref*R3)
- IREF=324004*((1*1000)/1000)/1.218
- AUTO PROGRAM CIRCUIT
- UREF=(79931*0.022*1000)/(1.218*(20*5))
- PREF=(4046*((1*1000)/1000)*0.022*1000)/(1.218*1.218*(20*5))
- IREF=266013
- UREF=14437
- PREF=600
- Rt = 1000:1
- LED INDICATION
- USB to UART
- USB TYPE-C
- Configuration Channel (CC) pin
   get 5V at up to 3A (15W)
